# Altium project AMC_uBACKPLANE.PrjPcb (part 3 of 4)

## Sheet Supply.SchDoc: Supply
size 420 x 297 mm; DocumentNumber: 9; SheetNumber: 6; SheetTotal: 15
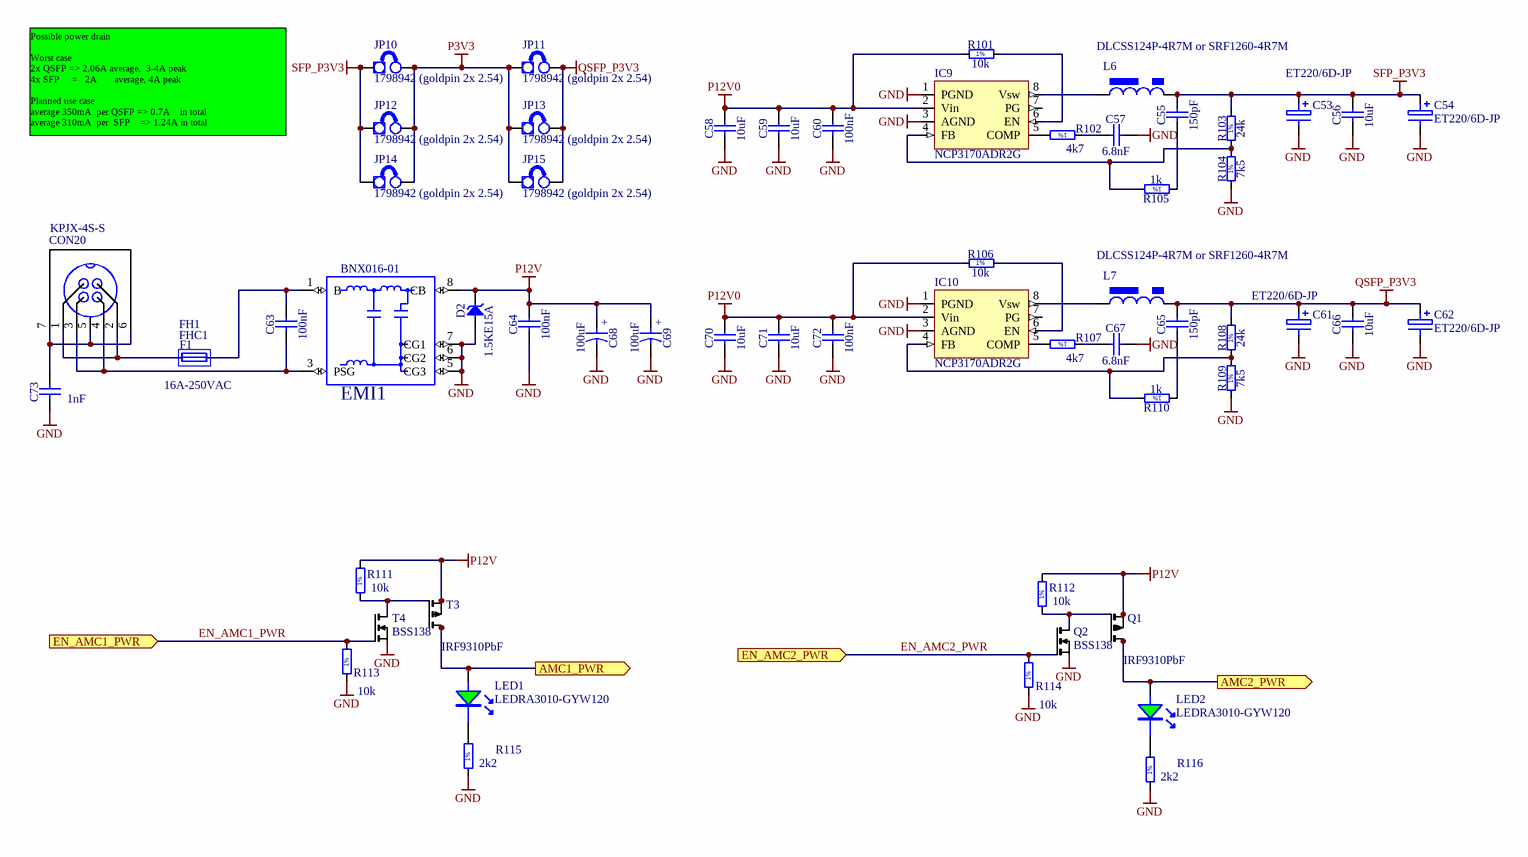
[diagram p9: Supply.SchDoc]

### Parts
C53  ET220/6D-JP  [2917_SMDD]
C54  ET220/6D-JP  [2917_SMDD]
C55  150pF  [CAPC1608X87N]
C56  10uF  [CAPC2012X135N]
C57  6.8nF  [CAPC1608X87N]
C58  10uF  [CAPC3216X140N]
C59  10uF  [CAPC3216X140N]
C60  100nF  [CAPC1005X55N]
C61  ET220/6D-JP  [2917_SMDD]
C62  ET220/6D-JP  [2917_SMDD]
C63  100nF  [CAPC1005X55N]
C64  100nF  [CAPC1005X55N]
C65  150pF  [CAPC1608X87N]
C66  10uF  [CAPC2012X135N]
C67  6.8nF  [CAPC1608X87N]
C68  100uF  [CAPMP7343X430N]
C69  100uF  [CAPMP7343X430N]
C70  10uF  [CAPC3216X140N]
C71  10uF  [CAPC3216X140N]
C72  100nF  [CAPC1005X55N]
C73  1nF  [CAPC3216X140N]
CON20  KPJX-4S-S  [CON_KPJX-4S-S]
D2  1.5KE15A  [VISHAY_1.5KE]
EMI1  BNX016-01  [BNX016-01]
F1  16A-250VAC  [FUSE_5X20_GLASS_h]
FH1  Fuse Holder  [FUSH_SCHURTER_OGN]  (value not drawn)
FHC1  Fuse Holder Cover No Pin  [FUSHC_SCHURTER_0853.0551]  (value not drawn)
IC9  NCP3170ADR2G  [so-8]
IC10  NCP3170ADR2G  [so-8]
JP10  1798942 (goldpin 2x 2.54)  [HEADER2x1 2.54mm]
JP11  1798942 (goldpin 2x 2.54)  [HEADER2x1 2.54mm]
JP12  1798942 (goldpin 2x 2.54)  [HEADER2x1 2.54mm]
JP13  1798942 (goldpin 2x 2.54)  [HEADER2x1 2.54mm]
JP14  1798942 (goldpin 2x 2.54)  [HEADER2x1 2.54mm]
JP15  1798942 (goldpin 2x 2.54)  [HEADER2x1 2.54mm]
L6  DLCSS124P-4R7M or SRF1260-4R7M  [choke_DLCSS124]
L7  DLCSS124P-4R7M or SRF1260-4R7M  [choke_DLCSS124]
LED1  LEDRA3010-GYW120  [LED_KPA3010_G]
LED2  LEDRA3010-GYW120  [LED_KPA3010_G]
Q1  IRF9310PbF  [so-8]
Q2  BSS138  [SOT95P251X112-3N]
R101  10k  [RESC1005X40N]
R102  4k7  [RESC1005X40N]
R103  24k  [RESC1608X55N]
R104  7k5  [RESC1608X55N]
R105  1k  [RESC1005X40N]
R106  10k  [RESC1005X40N]
R107  4k7  [RESC1005X40N]
R108  24k  [RESC1608X55N]
R109  7k5  [RESC1608X55N]
R110  1k  [RESC1005X40N]
R111  10k  [RESC1005X40N]
R112  10k  [RESC1005X40N]
R113  10k  [RESC1005X40N]
R114  10k  [RESC1005X40N]
R115  2k2  [RESC1005X40N]
R116  2k2  [RESC1005X40N]
T3  IRF9310PbF  [so-8]
T4  BSS138  [SOT95P251X112-3N]

### Ports
AMC1_PWR (out), AMC2_PWR (out), EN_AMC1_PWR (in), EN_AMC2_PWR (in)

### Nets
GND: C53.2 C54.2 C56.1 C57.2 C58.1 C59.1 C60.1 C61.2 C62.2 C64.1 C66.1 C67.2 C68.2 C69.2 C70.1 C71.1 C72.1 C73.1 D2.2(A) EMI1.5(CG3) EMI1.6(CG2) EMI1.7(CG1) IC9.1(PGND) IC9.3(AGND) IC10.1(PGND) IC10.3(AGND) Q2.2(S) R104.1 R109.1 R113.1 R114.1 R115.1 R116.1 T4.2(S)
P3V3: JP10.2(E2) JP11.1(E1) JP12.2(E2) JP13.1(E1) JP14.2(E2) JP15.1(E1)
P12V: C64.2 C68.1 C69.1 D2.1(C) EMI1.8(CB) Q1.1(S1) Q1.2(S1) Q1.3(S1) R111.2 R112.2 T3.1(S1) T3.2(S1) T3.3(S1)
P12V0: C58.2 C59.2 C60.2 C70.2 C71.2 C72.2 IC9.2(Vin) IC10.2(Vin) R101.1 R106.1
QSFP_P3V3: C61.1 C62.1 C65.2 C66.2 JP11.2(E2) JP13.2(E2) JP15.2(E2) L7.2 R108.2
SFP_P3V3: C53.1 C54.1 C55.2 C56.2 JP10.1(E1) JP12.1(E1) JP14.1(E1) L6.2 R103.2
AMC1_P12V: LED1.A T3.5(D1) T3.6(D1) T3.7(D1) T3.8(D1) ; port AMC1_PWR
AMC2_P12V: LED2.A Q1.5(D1) Q1.6(D1) Q1.7(D1) Q1.8(D1) ; port AMC2_PWR
EN_AMC1_PWR: R113.2 T4.1(G) ; port EN_AMC1_PWR  [project net AMC1_EN]
EN_AMC2_PWR: Q2.1(G) R114.2 ; port EN_AMC2_PWR  [project net AMC2_EN]
NetC55_1: C55.1 R105.1
NetC57_1: C57.1 R102.1
NetC63_1: C63.1 CON20.3 CON20.4 EMI1.3(PSG)
NetC63_2: C63.2 EMI1.1(B) FH1.2
NetC65_1: C65.1 R110.1
NetC67_1: C67.1 R107.1
NetC73_2: C73.2 CON20.5 CON20.6 CON20.7
NetCON20_1: CON20.1 CON20.2 FH1.1
NetIC9_4: IC9.4(FB) R103.1 R104.2 R105.2
NetIC9_5: IC9.5(COMP) R102.2
NetIC9_6: IC9.6(EN) R101.2
NetIC9_8: IC9.8(Vsw) L6.1
NetIC10_4: IC10.4(FB) R108.1 R109.2 R110.2
NetIC10_5: IC10.5(COMP) R107.2
NetIC10_6: IC10.6(EN) R106.2
NetIC10_8: IC10.8(Vsw) L7.1
NetLED1_K: LED1.K R115.2
NetLED2_K: LED2.K R116.2
NetQ1_4: Q1.4(G1) Q2.3(D) R112.1
NetR111_1: R111.1 T3.4(G1) T4.3(D)

Not connected (* = marked no-connect by the designer): IC9 7(PG); IC10 7(PG)

### Notes on the sheet
- Possible power drain
  Worst case
  2x QSFP => 2.06A average,  3-4A peak
  4x SFP     =   2A       average, 4A peak
  Planned use case
  average 350mA  per QSFP => 0.7A    in total
  average 310mA  per  SFP    => 1.24A in total
- Project/Equipment
- Document
- uTCA RTM 8 SFP+
- Designer
- Drawn by
- Check.by
- Copyright Creotech Instruments SA 2014.
  This documentation describes Open Hardware and is licensed under the CERN OHL v.1.1. You may redistribute and modify this documentation under the terms of the CERN OHL v.1.1. (http://ohwr.org/CERNOHL). This documentation is distributed WITHOUT ANY EXPRESS OR IMPLIED WARRANTY, INCLUDING OF MERCHANTABILITY, SATISFACTORY QUALITY AND FITNESS FOR A PARTICULAR PURPOSE. Please see the CERN OHL v.1.1 for applicable conditions.
- Creotech Instruments S.A.
- File
- Last Mod.
- Print Date
- Sheet
- Size
- A3
- of
- Rev
- (in symbol CTE7343-43_100UF_20V_10%_LESR0150) +
- (in symbol R0402_1K_1%_0.0625W_100PPM) 1%
- (in symbol R0402_2K2_1%_0.0625W_100PPM) 1%
- (in symbol R0402_4K7_1%_0.0625W_100PPM) 1%
- (in symbol R0402_10K_1%_0.0625W_100PPM) 1%
- (in symbol R0603_7K5_1%_0.1W_100PPM) 1%
- (in symbol R0603_24K_1%_0.1W_100PPM) 1%

### Library data of the parts
C53 C54 C61 C62 = CAP_TANTALIUM: Tantalium Capacitor
C55 C65 = CC0603_150PF_50V_5%_NP0: Non-polarised capacitor; Part Description: SMD Multilayer Chip Ceramic Capacitor; Manufacturer: GENERIC; Manufacturer1 Part Number: 223886715151; Voltage: 50V; TC: NP0; Tolerance: ±5%; Table: Capacitors SMD; Part Number: CC0603_150PF_50V_5%_NP0; Component Kind: Standard; Component Type: Standard; Pin Count: 2; Value: 150pF; Status: Preferred; Manufacturer Part Number: CC0603_150PF_50V_5%_NP0; Case: 0603; Mounted: Yes; Socket: No; SMD: Yes; Manufacturer1 Example: PHYCOMP; Manufacturer1 ComponentHeight: 0.87mm; HelpURL: \\cern.ch\dfs\Applications\Altium\Datasheets\CC0603_NP0_PHYCOMP.pdf; Author: CERN DEM JLC; CreateDate: 2007-12-03; LatestRevisionDate: 2007-12-03
C56 C66 = CC0805_10UF_10V_10%_X7R: Non-polarised capacitor; Part Description: SMD Multilayer Chip Ceramic Capacitor; Manufacturer: GENERIC; Manufacturer1 Part Number: GRM21BR71A106KE51L; Voltage: 10V; TC: X7R; Tolerance: ±10%; Table: Capacitors SMD; Part Number: CC0805_10UF_10V_10%_X7R; Component Kind: Standard; Component Type: Standard; Pin Count: 2; Value: 10uF; Status: Preferred; Manufacturer Part Number: CC0805_10UF_10V_10%_X7R; Case: 0805; Mounted: Yes; Socket: No; SMD: Yes; Manufacturer1 Example: MURATA; Manufacturer1 ComponentHeight: 1.35mm; HelpURL: \\cern.ch\dfs\Applications\Altium\Datasheets\CC0805_X7R_MURATA.pdf; Author: CERN DEM JLC; CreateDate: 2012-04-30; LatestRevisionDate: 2012-04-30
C57 C67 = CC0603_6.8NF_50V_5%_C0G: Non-polarised capacitor; Part Description: SMD Multilayer Chip Ceramic Capacitor; Manufacturer: GENERIC; Manufacturer1 Part Number: C0603C682J5GACTU; Voltage: 50V; TC: C0G; Tolerance: ±5%; Table: Capacitors SMD; Part Number: CC0603_6.8NF_50V_5%_C0G; Component Kind: Standard; Component Type: Standard; Pin Count: 2; Value: 6.8nF; Status: Preferred; Manufacturer Part Number: CC0603_6.8NF_50V_5%_C0G; Case: 0603; Mounted: Yes; Socket: No; SMD: Yes; Manufacturer1 Example: KEMET; Manufacturer1 ComponentHeight: 0.87mm; HelpURL: \\cern.ch\dfs\Applications\Altium\Datasheets\CC0603_C0G_KEMET.pdf; Author: CERN DEM JLC; CreateDate: 2013-10-01; LatestRevisionDate: 2013-10-01
C58 C59 C70 C71 = CC1206_10UF_16V_10%_X7R: Non-polarised capacitor; Part Description: SMD Multilayer Chip Ceramic Capacitor; Manufacturer: GENERIC; Manufacturer1 Part Number: C1206C106K4RAC; Voltage: 16V; TC: X7R; Tolerance: ±10%; Table: Capacitors SMD; Part Number: CC1206_10UF_16V_10%_X7R; Component Kind: Standard; Component Type: Standard; Pin Count: 2; Value: 10uF; Status: Preferred; Manufacturer Part Number: CC1206_10uF_16V_10%_X7R; Case: 1206; Mounted: Yes; Socket: No; SMD: Yes; Manufacturer1 Example: KEMET; Manufacturer1 ComponentHeight: 1.8mm; HelpURL: \\cern.ch\dfs\Applications\Altium\Datasheets\CC1206_X7R_KEMET.pdf; Author: CERN DEM JLC; CreateDate: 2009-04-28; LatestRevisionDate: 2009-04-28
C60 C63 C64 C72 = CC0402_100NF_16V_10%_X5R: Non-polarised capacitor; Part Description: SMD Multilayer Chip Ceramic Capacitor; Manufacturer: GENERIC; Manufacturer1 Part Number: GRM155R61C104KA88D; Voltage: 16V; TC: X5R; Tolerance: ±10%; Table: Capacitors SMD; Part Number: CC0402_100NF_16V_10%_X5R; Component Kind: Standard; Component Type: Standard; Pin Count: 2; Value: 100nF; Status: None; Manufacturer Part Number: CC0402_100NF_16V_10%_X5R; Case: 0402; Mounted: Yes; Socket: No; SMD: Yes; Manufacturer1 Example: MURATA; Manufacturer1 ComponentHeight: 0.55mm; HelpURL: \\cern.ch\dfs\Applications\Altium\Datasheets\CC0402_X5R_MURATA_GRM.pdf; Author: CERN DEM JLC; CreateDate: 2013-12-10; LatestRevisionDate: 2013-12-10
C68 C69 = CTE7343-43_100UF_20V_10%_LESR0150: Polarised capacitor; Part Description: Low ESR 0R15 Solid Tantalum Chip Capacitor; Manufacturer: GENERIC; Manufacturer1 Part Number: TPSE107K020R0150; Voltage: 20V; Tolerance: ±10%; Table: Capacitors SMD; Part Number: CTE7343-43_100UF_20V_10%_LESR0150; Component Kind: Standard; Component Type: Standard; Pin Count: 2; Value: 100uF; Status: Preferred; Manufacturer Part Number: CTE7343-43_100UF_20V_10%_LESR0150; Case: E; Mounted: Yes; Socket: No; SMD: Yes; Manufacturer1 Example: AVX; Manufacturer1 ComponentHeight: 4.3mm; HelpURL: \\cern.ch\dfs\Applications\Altium\Datasheets\CTE-LESR_AVX_TPS.pdf; Author: CERN DEM JLC; CreateDate: 2008-05-05; LatestRevisionDate: 2009-01-20
C73 = CC1206_1NF_100V_5%_NP0: Non-polarised capacitor; Part Description: SMD Multilayer Chip Ceramic Capacitor; Manufacturer: GENERIC; Manufacturer1 Part Number: 12061A102JAT2A; Voltage: 100V; TC: NP0; Tolerance: ±5%; Table: Capacitors SMD; Part Number: CC1206_1NF_100V_5%_NP0; Component Kind: Standard; Component Type: Standard; Pin Count: 2; Value: 1nF; Status: Preferred; Manufacturer Part Number: CC1206_1NF_100V_5%_NP0; Case: 1206; Mounted: Yes; Socket: No; SMD: Yes; Manufacturer1 Example: AVX; Manufacturer1 ComponentHeight: 0.94mm; HelpURL: \\cern.ch\dfs\Applications\Altium\Datasheets\CC1206_NP0_AVX.pdf; Author: CERN DEM JLC; CreateDate: 2011-04-06; LatestRevisionDate: 2011-04-06
CON20 = CON_DC_7.5A_4pin: 7.5A DC connector
D2 = 1.5KE15A: Transient Voltage Suppressor Diode (Uni-Directional); Part Description: Uni-directional  Transient Voltage Suppressor Diode - TRANSZORB®; Manufacturer: VISHAY GENERAL SEMICONDUCTOR; Voltage: 15V; Power: 1500W; Table: Diodes; Part Number: 1.5KE15A; Component Kind: Standard; Component Type: Standard; Device: 1.5KE15A; PackageDescription: VISHAY 1.5KE Case Style, Diode, Axial; Lead Spacing 20.32mm, Lead Dia. 1.07mm, Body Length 9.5mm, Body Dia. 5.3mm; Manufacturer Part Number: 1.5KE15A; Pin Count: 2; Mounted: Yes; Socket: No; SMD: No; ComponentHeight: 5.3mm; HelpURL: \\cern.ch\dfs\Applications\Altium\Datasheets\1.5KE.pdf; Author: CERN DEM JLC; CreateDate: 2012-12-11; LatestRevisionDate: 2012-12-11
EMI1 = L_CMC_BNX016-01.1: FILTER EMI 50MOHM 15A .1M-1GHZ; PART_TYPE: COMBINED; DXDB_LIBNAME: FILTERS; OWNER: 3709; DIST_P/N: 490-5055-ND; DIST: DIGIKEY; MANF: MURATA; DEVICE: BNX016-01; PKG_TYPE: BNX016-01; MANF_P/N: BNX016-01; DATASHEET: \\XSJ-SMB\AFX\AFX\BOARD_PROJECTS\LIBRARY\\DATASHEETS\FILTER\L0117BNX01.PDF; ROHS: YES; CURRENT: 15A; VALUE: 50MOHM
F1 = FUSE_SCHURTER_0034.3129_h: Fuse; Part Description: Cylindrical 5x20 mm, Time-Lag T Miniature Fuse, FST Serie; Table: Fuses; Part Number: FUSE_SCHURTER_0034.3129_h; Component Kind: Standard; Component Type: Standard; Pin Count: 0; PackageDescription: 5x20mm Cylindrical Fuse, SCHURTER FST5X20 Serie; Family: Fuse; Mounted: Yes; Socket: Yes; SMD: No; Value: 16A-250VAC; Manufacturer: SCHURTER; Manufacturer Part Number: 0034.3129; ComponentHeight: 5.2mm; HelpURL: \\cern.ch\dfs\Applications\Altium\Datasheets\FUSE_SCHURTER_FST5X20.pdf; Author: CERN DEM JLC; CreateDate: 2013-01-28; LatestRevisionDate: 2013-01-28
FH1 = FUSH_SCHURTER-OGN_0031.8211: Part Description: Fuse holder for 5x20mm Fuses; Table: Fuses; Part Number: FUSH_SCHURTER-OGN_0031.8211; Component Kind: Standard; Component Type: Standard; Pin Count: 2; PackageDescription: SCHURTER OGN Series, Fuse holder for 5x20mm Fuses; Family: Fuse Holder; Mounted: Yes; Socket: No; SMD: No; Manufacturer: SCHURTER; Manufacturer Part Number: 0031.8211; ComponentHeight: 11.5mm; HelpURL: \\cern.ch\dfs\Applications\Altium\Datasheets\FUSH_SCHURTER_OGN.pdf; Author: CERN DEM JLC; CreateDate: 2008-06-03; LatestRevisionDate: 2008-07-02
FHC1 = FUSHC_SCHURTER_0853.0551: Part Description: Cover for Fuse Holder OGN, OGN-SMD; Table: Fuses; Part Number: FUSHC_SCHURTER_0853.0551; Component Kind: Standard; Component Type: Standard; Pin Count: 0; PackageDescription: Cover for Fuse Holder OGN, OGN-SMD; Family: Fuse Holder Cover; Mounted: Yes; Socket: No; SMD: No; Manufacturer: SCHURTER; Manufacturer Part Number: 0853.0551; ComponentHeight: 12.5mm; HelpURL: \\cern.ch\dfs\Applications\Altium\Datasheets\FUSHC_SCHURTER_0853.0551.pdf; Author: CERN DEM JLC; CreateDate: 2013-03-06; LatestRevisionDate: 2013-03-06
IC9 IC10 = PWM_NCP3170: 4.5V to 18V, 3A synch buck
JP10-JP15 = JUMPER: Supplier 1: Farnell; Supplier Part Number 1: 1798942
L6 L7 = L_POWER_CSS124_6.8uH: Shielded Ferrite base SMD Power Choke DLCSS124P Series 4.7uH, 20%, 5.7A, 0.018R, 750pcs/reel
LED1 LED2 = LED_SMD_90deg_G: LED (Maritex); Supplier 1: Farnell; Supplier Part Number 1: 8530335RL
Q1 T3 = Q_IRF9310: PMOS 30V, 4.6mR, 20A, 2.5W
Q2 T4 = Q_BSS138
R101 R106 R111-R114 = R0402_10K_1%_0.0625W_100PPM: Resistor - 1%; Part Description: General Purpose Thick Film Chip Resistor; Manufacturer: GENERIC; Manufacturer1 Part Number: 232270671003L; TC: ±100ppm/°C; Table: Resistors SMD; Part Number: R0402_10K_1%_0.0625W_100PPM; Component Kind: Standard; Component Type: Standard; Pin Count: 2; Value: 10k; Status: Not recommended; Power: 0.0625W; Tolerance: ±1%; Manufacturer Part Number: R0402_10K_1%_0.0625W_100PPM; Case: 0402; Mounted: Yes; Socket: No; SMD: Yes; Manufacturer1 Example: YAGEO PHYCOMP; Manufacturer1 ComponentHeight: 0.4mm; HelpURL: \\cern.ch\dfs\Applications\Altium\Datasheets\R0402_Phycomp_RC0402.pdf; Author: CERN DEM JLC; CreateDate: 2007-12-03; LatestRevisionDate: 2012-10-17
R102 R107 = R0402_4K7_1%_0.0625W_100PPM: Resistor - 1%; Part Description: General Purpose Thick Film Chip Resistor; Manufacturer: GENERIC; Manufacturer1 Part Number: 232270674702L; TC: ±100ppm/°C; Table: Resistors SMD; Part Number: R0402_4K7_1%_0.0625W_100PPM; Component Kind: Standard; Component Type: Standard; Pin Count: 2; Value: 4k7; Status: Not recommended; Power: 0.0625W; Tolerance: ±1%; Manufacturer Part Number: R0402_4K7_1%_0.0625W_100PPM; Case: 0402; Mounted: Yes; Socket: No; SMD: Yes; Manufacturer1 Example: YAGEO PHYCOMP; Manufacturer1 ComponentHeight: 0.4mm; HelpURL: \\cern.ch\dfs\Applications\Altium\Datasheets\R0402_Phycomp_RC0402.pdf; Author: CERN DEM JLC; CreateDate: 2007-12-03; LatestRevisionDate: 2012-10-17
R103 R108 = R0603_24K_1%_0.1W_100PPM: Resistor - 1%; Part Description: General Purpose Thick Film Chip Resistor; Manufacturer: GENERIC; Manufacturer1 Part Number: NRC06F2402TRF; Power: 0.1W; TC: ±100ppm/°C; Table: Resistors SMD; Part Number: R0603_24K_1%_0.1W_100PPM; Component Kind: Standard; Component Type: Standard; Pin Count: 2; Value: 24k; Status: Preferred; Tolerance: ±1%; Manufacturer Part Number: R0603_24K_1%_0.1W_100PPM; Case: 0603; Mounted: Yes; Socket: No; SMD: Yes; Manufacturer1 Example: NIC COMPONENT; Manufacturer1 ComponentHeight: 0.55mm; HelpURL: \\cern.ch\dfs\Applications\Altium\Datasheets\R0603_NIC_NRC.pdf; Author: CERN DEM JLC; CreateDate: 2007-12-03; LatestRevisionDate: 2008-03-13
R104 R109 = R0603_7K5_1%_0.1W_100PPM: Resistor - 1%; Part Description: General Purpose Thick Film Chip Resistor; Manufacturer: GENERIC; Manufacturer1 Part Number: NRC06F7501TRF; Power: 0.1W; TC: ±100ppm/°C; Table: Resistors SMD; Part Number: R0603_7K5_1%_0.1W_100PPM; Component Kind: Standard; Component Type: Standard; Pin Count: 2; Value: 7k5; Status: Preferred; Tolerance: ±1%; Manufacturer Part Number: R0603_7K5_1%_0.1W_100PPM; Case: 0603; Mounted: Yes; Socket: No; SMD: Yes; Manufacturer1 Example: NIC COMPONENT; Manufacturer1 ComponentHeight: 0.55mm; HelpURL: \\cern.ch\dfs\Applications\Altium\Datasheets\R0603_NIC_NRC.pdf; Author: CERN DEM JLC; CreateDate: 2007-12-03; LatestRevisionDate: 2008-03-13
R105 R110 = R0402_1K_1%_0.0625W_100PPM: Resistor - 1%; Part Description: General Purpose Thick Film Chip Resistor; Manufacturer: GENERIC; Manufacturer1 Part Number: 232270671002L; TC: ±100ppm/°C; Table: Resistors SMD; Part Number: R0402_1K_1%_0.0625W_100PPM; Component Kind: Standard; Component Type: Standard; Pin Count: 2; Value: 1k; Status: Not recommended; Power: 0.0625W; Tolerance: ±1%; Manufacturer Part Number: R0402_1K_1%_0.0625W_100PPM; Case: 0402; Mounted: Yes; Socket: No; SMD: Yes; Manufacturer1 Example: YAGEO PHYCOMP; Manufacturer1 ComponentHeight: 0.4mm; HelpURL: \\cern.ch\dfs\Applications\Altium\Datasheets\R0402_Phycomp_RC0402.pdf; Author: CERN DEM JLC; CreateDate: 2007-12-03; LatestRevisionDate: 2012-10-17
R115 R116 = R0402_2K2_1%_0.0625W_100PPM: Resistor - 1%; Part Description: General Purpose Thick Film Chip Resistor; Manufacturer: GENERIC; Manufacturer1 Part Number: 232270672202L; TC: ±100ppm/°C; Table: Resistors SMD; Part Number: R0402_2K2_1%_0.0625W_100PPM; Component Kind: Standard; Component Type: Standard; Pin Count: 2; Value: 2k2; Status: Not recommended; Power: 0.0625W; Tolerance: ±1%; Manufacturer Part Number: R0402_2K2_1%_0.0625W_100PPM; Case: 0402; Mounted: Yes; Socket: No; SMD: Yes; Manufacturer1 Example: YAGEO PHYCOMP; Manufacturer1 ComponentHeight: 0.4mm; HelpURL: \\cern.ch\dfs\Applications\Altium\Datasheets\R0402_Phycomp_RC0402.pdf; Author: CERN DEM JLC; CreateDate: 2007-12-03; LatestRevisionDate: 2012-10-17

## Sheet USB_UART.SchDoc: USB UART
size 420 x 297 mm; DocumentNumber: 11; SheetNumber: 12; SheetTotal: 15
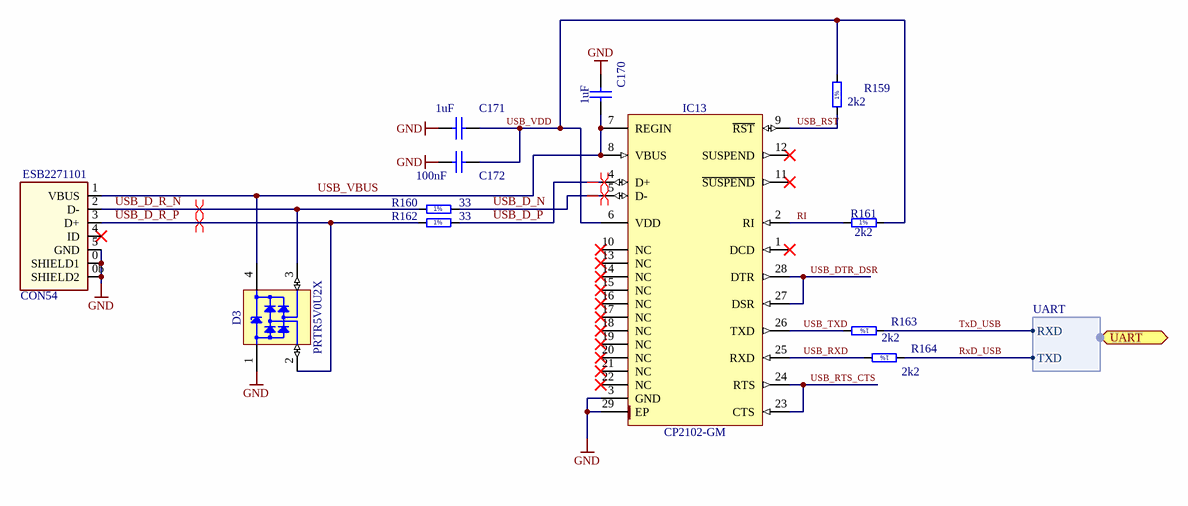
[diagram p10: USB_UART.SchDoc]

### Parts
C170  1uF  [CAPC1608X87N]
C171  1uF  [CAPC1608X87N]
C172  100nF  [CAPC0603X33N]
CON54  ESB2271101  [USB_MICRO_ESB2271101]
D3  PRTR5V0U2X  [SOT190P230X110-4N]
IC13  CP2102-GM  [QFN50P500X500X100-29N-S335]
R159  2k2  [RESC1005X40N]
R160  33  [RESC1005X40N]
R161  2k2  [RESC1005X40N]
R162  33  [RESC1005X40N]
R163  2k2  [RESC1005X40N]
R164  2k2  [RESC1005X40N]

### Ports
UART (harness UART)

### Harnesses
UART: RXD, TXD

### Nets
GND: C170.1 C171.1 C172.1 CON54.0(SHIELD1) CON54.0a(SHIELD1) CON54.0b(SHIELD2) CON54.0c(SHIELD2) CON54.5(GND) D3.1(GND) IC13.3(GND) IC13.29(EP)
RI: IC13.2(RI) R161.1
RxD_USB: R164.1 ; port UART.TXD  [project net UART.TXD]
TxD_USB: R163.1 ; port UART.RXD  [project net UART.RXD]
USB_D_N: IC13.5(D-) R160.2
USB_D_P: IC13.4(D+) R162.2
USB_D_R_N: CON54.2(D-) D3.3(I/O2) R160.1
USB_D_R_P: CON54.3(D+) D3.2(I/O1) R162.1
USB_DTR_DSR: IC13.27(DSR) IC13.28(DTR)
USB_RST: IC13.9(~{RST}) R159.1
USB_RTS_CTS: IC13.23(CTS) IC13.24(RTS)
USB_RXD: IC13.25(RXD) R164.2
USB_TXD: IC13.26(TXD) R163.2
USB_VBUS: C170.2 CON54.1(VBUS) D3.4(VCC) IC13.7(REGIN) IC13.8(VBUS)
USB_VDD: C171.2 C172.2 IC13.6(VDD) R159.2 R161.2

Not connected (* = marked no-connect by the designer): CON54 4(ID)*; IC13 1(DCD)* 10(NC)* 11(~{SUSPEND})* 12(SUSPEND)* 13(NC)* 14(NC)* 15(NC)* 16(NC)* 17(NC)* 18(NC)* 19(NC)* 20(NC)* 21(NC)* 22(NC)*

### Layout directives
differential pair: USB_D_N, USB_D_P, USB_D_R_N, USB_D_R_P

### Notes on the sheet
- Project/Equipment
- Document
- uTCA RTM 8 SFP+
- Designer
- Drawn by
- Check.by
- Copyright Creotech Instruments SA 2014.
  This documentation describes Open Hardware and is licensed under the CERN OHL v.1.1. You may redistribute and modify this documentation under the terms of the CERN OHL v.1.1. (http://ohwr.org/CERNOHL). This documentation is distributed WITHOUT ANY EXPRESS OR IMPLIED WARRANTY, INCLUDING OF MERCHANTABILITY, SATISFACTORY QUALITY AND FITNESS FOR A PARTICULAR PURPOSE. Please see the CERN OHL v.1.1 for applicable conditions.
- Creotech Instruments S.A.
- File
- Last Mod.
- Print Date
- Sheet
- Size
- A3
- of
- Rev
- (in symbol R0402_2K2_1%_0.0625W_100PPM) 1%
- (in symbol R0402_33R_1%_0.0625W_100PPM) 1%

### Library data of the parts
C170 C171 = CC0603_1UF_16V_10%_X7R: Non-polarised capacitor; Part Description: SMD Multilayer Chip Ceramic Capacitor; Manufacturer: GENERIC; Manufacturer1 Part Number: 223824613663; Voltage: 16V; TC: X7R; Tolerance: ±10%; Table: Capacitors SMD; Part Number: CC0603_1UF_16V_10%_X7R; Component Kind: Standard; Component Type: Standard; Pin Count: 2; Value: 1uF; Status: Preferred; Manufacturer Part Number: CC0603_1uF_16V_10%_X7R; Case: 0603; Mounted: Yes; Socket: No; SMD: Yes; Manufacturer1 Example: PHYCOMP; Manufacturer1 ComponentHeight: 0.87mm; HelpURL: \\cern.ch\dfs\Applications\Altium\Datasheets\CC0805_X5R_PHYCOMP_HC.pdf; Author: CERN DEM JLC; CreateDate: 2007-12-03; LatestRevisionDate: 2007-12-03
C172 = CC0201_100NF_6.3V_10%_X5R: as C74-C78 on sheet AMC; Part Number: CC0201_100NF_6.3V_10%_X5R; Component Kind: Standard; Component Type: Standard; Pin Count: 2; Value: 100nF; Status: Not Recommended; Manufacturer Part Number: CC0201_100NF_6.3V_10%_X5R; Case: 0201; Mounted: Yes; Socket: No; SMD: Yes; Manufacturer1 Example: AVX; Manufacturer1 ComponentHeight: 0.33mm; HelpURL: \\cern.ch\dfs\Applications\Altium\Datasheets\CC0201_X5R_AVX.pdf; Author: CERN DEM JLC; CreateDate: 2007-12-03; LatestRevisionDate: 2007-12-03
CON54 = CON_USB_AB_MICRO: USB micro AB connector; Part Number: 10133; Device: USB_Mini_AB
D3 = PRTR5V0U2X: Ultra Low Capacitance Double Rail-to-Rail ESD Protection Diode; Part Description: Ultra Low Capacitance (1pF) Double Rail-to-Rail ESD Protection Diode (8kV); Manufacturer: NXP SEMICONDUCTORS; Voltage: 5.5V; Table: Diodes; Part Number: PRTR5V0U2X; Component Kind: Standard; Component Type: Standard; Device: PRTR5V0U2X; PackageDescription: SOT143B, SOT, 1.90mm Pitch; 4 Pin, 1.30mm W X 2.90mm L X 1.10mm H body, IPC Medium Density; Manufacturer Part Number: PRTR5V0U2X; Pin Count: 4; Case: SOT143B; Mounted: Yes; Socket: No; SMD: Yes; ComponentHeight: 1.1mm; HelpURL: \\cern.ch\dfs\Applications\Altium\Datasheets\PRTR5V0U2X.pdf; Author: CERN DEM JLC; CreateDate: 2011-03-22; LatestRevisionDate: 2011-03-22
IC13 = CP2102-GM: Single-Chip USB to UART Bridge; Manufacturer: SILICON LABS; Table: Analog & Interface; Part Number: CP2102-GM; Component Kind: Standard; Component Type: Standard; Device: CP2102-GM; PackageDescription: QFN, 0.50mm Pitch, Square; 28 pin, 5.00mm L X 5.00mm W X 1.00mm H body (w/thermal tab 3.35 X 3.35mm),  IPC Medium Density; Part Description: Single-Chip USB to UART Bridge; Manufacturer Part Number: CP2102-GM; Pin Count: 29; Case: QFN28; Mounted: Yes; Socket: No; SMD: Yes; ComponentHeight: 1.0mm; Author: CERN DEM JLC; HelpURL: \\cern.ch\dfs\Applications\Altium\Datasheets\CP2102-GM.pdf; CreateDate: 3/3/2011; LatestRevisionDate: 3/3/2011
R159 R161 R163 R164 = R0402_2K2_1%_0.0625W_100PPM: as R115 on sheet Supply; Part Number: R0402_2K2_1%_0.0625W_100PPM; Component Kind: Standard; Component Type: Standard; Pin Count: 2; Value: 2k2; Status: Not recommended; Power: 0.0625W; Tolerance: ±1%; Manufacturer Part Number: R0402_2K2_1%_0.0625W_100PPM; Case: 0402; Mounted: Yes; Socket: No; SMD: Yes; Manufacturer1 Example: YAGEO PHYCOMP; Manufacturer1 ComponentHeight: 0.4mm; HelpURL: \\cern.ch\dfs\Applications\Altium\Datasheets\R0402_Phycomp_RC0402.pdf; Author: CERN DEM JLC; CreateDate: 2007-12-03; LatestRevisionDate: 2012-10-17
R160 R162 = R0402_33R_1%_0.0625W_100PPM: Resistor - 1%; Part Description: General Purpose Thick Film Chip Resistor; Manufacturer: GENERIC; Manufacturer1 Part Number: 232270673309L; TC: ±100ppm/°C; Table: Resistors SMD; Part Number: R0402_33R_1%_0.0625W_100PPM; Component Kind: Standard; Component Type: Standard; Pin Count: 2; Value: 33; Status: Not recommended; Power: 0.0625W; Tolerance: ±1%; Manufacturer Part Number: R0402_33R_1%_0.0625W_100PPM; Case: 0402; Mounted: Yes; Socket: No; SMD: Yes; Manufacturer1 Example: YAGEO PHYCOMP; Manufacturer1 ComponentHeight: 0.4mm; HelpURL: \\cern.ch\dfs\Applications\Altium\Datasheets\R0402_Phycomp_RC0402.pdf; Author: CERN DEM JLC; CreateDate: 2007-12-03; LatestRevisionDate: 2012-10-17

## Sheet ETH_PHY.SchDoc: ETH PHY
size 420 x 297 mm; DocumentNumber: 5; SheetNumber: 14; SheetTotal: 15
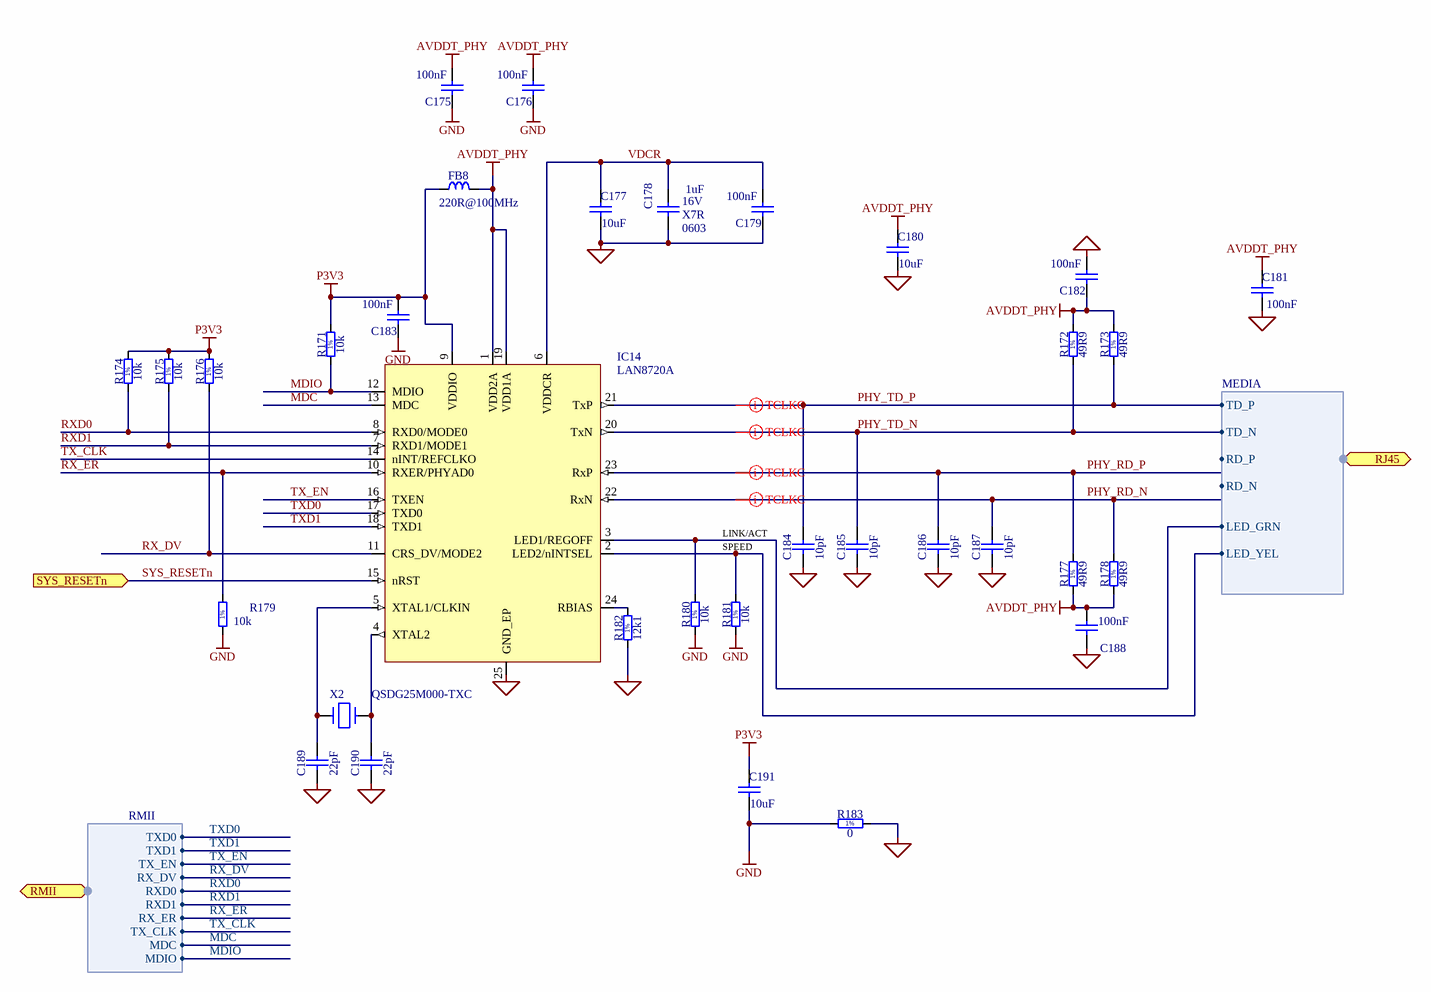
[diagram p11: ETH_PHY.SchDoc]

### Parts
C175  100nF  [CAPC1005X55N]
C176  100nF  [CAPC1005X55N]
C177  10uF  [CAPC2012X135N]
C178  1uF  Voltage: 16V  TC: X7R  Case: 0603  [CAPC1608X87N]
C179  100nF  [CAPC1005X55N]
C180  10uF  [CAPC2012X135N]
C181  100nF  [CAPC1005X55N]
C182  100nF  [CAPC1005X55N]
C183  100nF  [CAPC1005X55N]
C184  10pF  [CAPC1005X55N]
C185  10pF  [CAPC1005X55N]
C186  10pF  [CAPC1005X55N]
C187  10pF  [CAPC1005X55N]
C188  100nF  [CAPC1005X55N]
C189  22pF  [CAPC1005X55N]
C190  22pF  [CAPC1005X55N]
C191  10uF  [CAPC2012X135N]
FB8  220R@100MHz  [INDC2012X105N]
IC14  LAN8720A  [QFN24-TP]
R171  10k  [RESC1005X40N]
R172  49R9  [RESC1005X40N]
R173  49R9  [RESC1005X40N]
R174  10k  [RESC1005X40N]
R175  10k  [RESC1005X40N]
R176  10k  [RESC1005X40N]
R177  49R9  [RESC1005X40N]
R178  49R9  [RESC1005X40N]
R179  10k  [RESC1005X40N]
R180  10k  [RESC1005X40N]
R181  10k  [RESC1005X40N]
R182  12k1  [RESC1005X40N]
R183  0  [RESC1608X55N]
X2  QSDG25M000-TXC  [XTAL_5.0*3.2]

### Ports
RJ45 (harness MEDIA), RMII (harness RMII), SYS_RESETn (in)

### Harnesses
RMII: TXD0, TXD1, TX_EN, RX_DV, RXD0, RXD1, RX_ER, TX_CLK, MDC, MDIO
MEDIA: TD_P, TD_N, RD_P, RD_N, LED_GRN, LED_YEL

### Nets
AVDDT_PHY: C175.1 C176.1 C180.1 C181.2 C182.2 C188.1 FB8.2 IC14.1(VDD2A) IC14.19(VDD1A) R172.2 R173.2 R177.1 R178.1
GND: C175.2 C176.2 C183.2 C191.2 R179.1 R180.1 R181.1 R183.1
GND_ETH: C177.2 C178.1 C179.2 C180.2 C181.1 C182.1 C184.1 C185.1 C186.1 C187.1 C188.2 C189.1 C190.1 IC14.25(GND_EP) R182.1 R183.2
P3V3: C183.1 C191.1 FB8.1 IC14.9(VDDIO) R171.2 R174.2 R175.2 R176.2
MDC: IC14.13(MDC) ; port RMII.MDC  [project net RMII.MDC]
MDIO: IC14.12(MDIO) R171.1 ; port RMII.MDIO  [project net RMII.MDIO]
PHY_RD_N: C187.2 IC14.22(RxN) R178.2
PHY_RD_P: C186.2 IC14.23(RxP) R177.2
PHY_TD_N: C185.2 IC14.20(TxN) R172.1 ; port RJ45.TD_N  [project net RJ45.TD_N]
PHY_TD_P: C184.2 IC14.21(TxP) R173.1 ; port RJ45.TD_P  [project net RJ45.TD_P]
RJ45.LED_GRN: IC14.3(LED1/REGOFF) R180.2 ; port RJ45.LED_GRN
RJ45.LED_YEL: IC14.2(LED2/nINTSEL) R181.2 ; port RJ45.LED_YEL
RX_DV: IC14.11(CRS_DV/MODE2) R176.1 ; port RMII.RX_DV  [project net RMII.RX_DV]
RX_ER: IC14.10(RXER/PHYAD0) R179.2 ; port RMII.RX_ER  [project net RMII.RX_ER]
RXD0: IC14.8(RXD0/MODE0) R174.1 ; port RMII.RXD0  [project net RMII.RXD0]
RXD1: IC14.7(RXD1/MODE1) R175.1 ; port RMII.RXD1  [project net RMII.RXD1]
SYS_RESETn: IC14.15(nRST) ; port SYS_RESETn  [project net RSTO]
TX_CLK: IC14.14(nINT/REFCLKO) ; port RMII.TX_CLK  [project net RMII.TX_CLK]
TX_EN: IC14.16(TXEN) ; port RMII.TX_EN  [project net RMII.TX_EN]
TXD0: IC14.17(TXD0) ; port RMII.TXD0  [project net RMII.TXD0]
TXD1: IC14.18(TXD1) ; port RMII.TXD1  [project net RMII.TXD1]
VDCR: C177.1 C178.2 C179.1 IC14.6(VDDCR)
NetC189_2: C189.2 IC14.5(XTAL1/CLKIN) X2.1
NetC190_2: C190.2 IC14.4(XTAL2) X2.2
NetIC14_24: IC14.24(RBIAS) R182.2

### Layout directives
differential pair: PHY_RD_N, PHY_RD_P, RJ45.TD_N, RJ45.TD_P

### Notes on the sheet
- SPEED
- LINK/ACT
- Project/Equipment
- Document
- uTCA RTM 8 SFP+
- Designer
- Drawn by
- Check.by
- Copyright Creotech Instruments SA 2014.
  This documentation describes Open Hardware and is licensed under the CERN OHL v.1.1. You may redistribute and modify this documentation under the terms of the CERN OHL v.1.1. (http://ohwr.org/CERNOHL). This documentation is distributed WITHOUT ANY EXPRESS OR IMPLIED WARRANTY, INCLUDING OF MERCHANTABILITY, SATISFACTORY QUALITY AND FITNESS FOR A PARTICULAR PURPOSE. Please see the CERN OHL v.1.1 for applicable conditions.
- Creotech Instruments S.A.
- File
- Last Mod.
- Print Date
- Sheet
- Size
- A3
- of
- Rev
- (in symbol R0402_10K_1%_0.0625W_100PPM) 1%
- (in symbol R0402_12K1_1%_0.0625W_100PPM) 1%
- (in symbol R0402_49R9_1%_0.0625W_100PPM) 1%
- (in symbol R0603_0R_JUMPER) 1%

### Library data of the parts
C175 C176 C179 C181-C183 C188 = CC0402_100NF_16V_10%_X7R: Non-polarised capacitor; Part Description: SMD Multilayer Chip Ceramic Capacitor; Manufacturer: GENERIC; Manufacturer1 Part Number: 223878715649; Voltage: 16V; TC: X7R; Tolerance: ±10%; Table: Capacitors SMD; Part Number: CC0402_100NF_16V_10%_X7R; Component Kind: Standard; Component Type: Standard; Pin Count: 2; Value: 100nF; Status: Not Recommended; Manufacturer Part Number: CC0402_100NF_16V_10%_X7R; Case: 0402; Mounted: Yes; Socket: No; SMD: Yes; Manufacturer1 Example: PHYCOMP; Manufacturer1 ComponentHeight: 0.55mm; HelpURL: \\cern.ch\dfs\Applications\Altium\Datasheets\CC0402_X7R_PHYCOMP.pdf; Author: CERN DEM JLC; CreateDate: 2007-12-03; LatestRevisionDate: 2007-12-03
C177 C180 C191 = CC0805_10UF_10V_10%_X7R: as C56 on sheet Supply; Part Number: CC0805_10UF_10V_10%_X7R; Component Kind: Standard; Component Type: Standard; Pin Count: 2; Value: 10uF; Status: Preferred; Manufacturer Part Number: CC0805_10UF_10V_10%_X7R; Case: 0805; Mounted: Yes; Socket: No; SMD: Yes; Manufacturer1 Example: MURATA; Manufacturer1 ComponentHeight: 1.35mm; HelpURL: \\cern.ch\dfs\Applications\Altium\Datasheets\CC0805_X7R_MURATA.pdf; Author: CERN DEM JLC; CreateDate: 2012-04-30; LatestRevisionDate: 2012-04-30
C178 = CC0603_1UF_16V_10%_X7R: Non-polarised capacitor; Part Description: SMD Multilayer Chip Ceramic Capacitor; Manufacturer: GENERIC; Manufacturer1 Part Number: 223824613663; Tolerance: ±10%; Table: Capacitors SMD; Part Number: CC0603_1UF_16V_10%_X7R; Component Kind: Standard; Component Type: Standard; Pin Count: 2; Value: 1uF; Status: Preferred; Manufacturer Part Number: CC0603_1uF_16V_10%_X7R; Mounted: Yes; Socket: No; SMD: Yes; Manufacturer1 Example: PHYCOMP; Manufacturer1 ComponentHeight: 0.87mm; HelpURL: \\cern.ch\dfs\Applications\Altium\Datasheets\CC0805_X5R_PHYCOMP_HC.pdf; Author: CERN DEM JLC; CreateDate: 12/3/2007; LatestRevisionDate: 12/3/2007
C184-C187 = CC0402_10PF_50V_5%_NP0: Non-polarised capacitor; Part Description: SMD Multilayer Chip Ceramic Capacitor; Manufacturer: GENERIC; Manufacturer1 Part Number: 223886915109; Voltage: 50V; TC: NP0; Tolerance: ±5%; Table: Capacitors SMD; Part Number: CC0402_10PF_50V_5%_NP0; Component Kind: Standard; Component Type: Standard; Pin Count: 2; Value: 10pF; Status: Not Recommended; Manufacturer Part Number: CC0402_10PF_50V_5%_NP0; Case: 0402; Mounted: Yes; Socket: No; SMD: Yes; Manufacturer1 Example: PHYCOMP; Manufacturer1 ComponentHeight: 0.55mm; HelpURL: \\cern.ch\dfs\Applications\Altium\Datasheets\CC0402_NP0_PHYCOMP.pdf; Author: CERN DEM JLC; CreateDate: 2007-12-03; LatestRevisionDate: 2007-12-03
C189 C190 = CC0402_22PF_50V_5%_NP0: Non-polarised capacitor; Part Description: SMD Multilayer Chip Ceramic Capacitor; Manufacturer: GENERIC; Manufacturer1 Part Number: 223886915229; Voltage: 50V; TC: NP0; Tolerance: ±5%; Table: Capacitors SMD; Part Number: CC0402_22PF_50V_5%_NP0; Component Kind: Standard; Component Type: Standard; Pin Count: 2; Value: 22pF; Status: Not Recommended; Manufacturer Part Number: CC0402_22PF_50V_5%_NP0; Case: 0402; Mounted: Yes; Socket: No; SMD: Yes; Manufacturer1 Example: PHYCOMP; Manufacturer1 ComponentHeight: 0.55mm; HelpURL: \\cern.ch\dfs\Applications\Altium\Datasheets\CC0402_NP0_PHYCOMP.pdf; Author: CERN DEM JLC; CreateDate: 2007-12-03; LatestRevisionDate: 2007-12-03
FB8 = IND0805_MURATA_BLM21PG221SN1D: Inductor; Part Description: SMD EMIFIL Suppression Chip Ferrite Bead; Manufacturer: MURATA; Power: 2A; Resistance: 0.05R; Tolerance: ±25%; Table: Inductors SMD; Part Number: IND0805_MURATA_BLM21PG221SN1D; Component Kind: Standard; Component Type: Standard; Pin Count: 2; Value: 220R@100MHz; Status: None; Manufacturer Part Number: BLM21PG221SN1D; Case: 0805; Mounted: Yes; Socket: No; SMD: Yes; ComponentHeight: 1.05mm; HelpURL: \\cern.ch\dfs\Applications\Altium\Datasheets\IND0402_MURATA_BLM21P.pdf; Author: CERN DEM JLC; CreateDate: 2010-01-25; LatestRevisionDate: 2010-01-25
IC14 = IFC_LAN8710A: RMII ethernet transceiver with auto MIDIX
R171 R174-R176 R179-R181 = R0402_10K_1%_0.0625W_100PPM: as R101 on sheet Supply; Part Number: R0402_10K_1%_0.0625W_100PPM; Component Kind: Standard; Component Type: Standard; Pin Count: 2; Value: 10k; Status: Not recommended; Power: 0.0625W; Tolerance: ±1%; Manufacturer Part Number: R0402_10K_1%_0.0625W_100PPM; Case: 0402; Mounted: Yes; Socket: No; SMD: Yes; Manufacturer1 Example: YAGEO PHYCOMP; Manufacturer1 ComponentHeight: 0.4mm; HelpURL: \\cern.ch\dfs\Applications\Altium\Datasheets\R0402_Phycomp_RC0402.pdf; Author: CERN DEM JLC; CreateDate: 2007-12-03; LatestRevisionDate: 2012-10-17
R172 R173 R177 R178 = R0402_49R9_1%_0.0625W_100PPM: Resistor - 1%; Part Description: General Purpose Thick Film Chip Resistor; Manufacturer: GENERIC; Manufacturer1 Part Number: 232270674999L or RC0402FR-0749R9L; TC: ±100ppm/°C; Table: Resistors SMD; Part Number: R0402_49R9_1%_0.0625W_100PPM; Component Kind: Standard; Component Type: Standard; Pin Count: 2; Value: 49R9; Status: Not recommended; Power: 0.0625W; Tolerance: ±1%; Manufacturer Part Number: R0402_49R9_1%_0.0625W_100PPM; Case: 0402; Mounted: Yes; Socket: No; SMD: Yes; Manufacturer1 Example: YAGEO PHYCOMP; Manufacturer1 ComponentHeight: 0.4mm; HelpURL: \\cern.ch\dfs\Applications\Altium\Datasheets\R0402_Phycomp_RC0402.pdf; Author: CERN DEM JLC; CreateDate: 2012-10-24; LatestRevisionDate: 2012-10-24
R182 = R0402_12K1_1%_0.0625W_100PPM: Resistor - 1%; Part Description: General Purpose Thick Film Chip Resistor; Manufacturer: GENERIC; Manufacturer1 Part Number: 232270671213L or RC0402FR-0712K1L; TC: ±100ppm/°C; Table: Resistors SMD; Part Number: R0402_12K1_1%_0.0625W_100PPM; Component Kind: Standard; Component Type: Standard; Pin Count: 2; Value: 12k1; Status: Not recommended; Power: 0.0625W; Tolerance: ±1%; Manufacturer Part Number: R0402_12K1_1%_0.0625W_100PPM; Case: 0402; Mounted: Yes; Socket: No; SMD: Yes; Manufacturer1 Example: YAGEO PHYCOMP; Manufacturer1 ComponentHeight: 0.4mm; HelpURL: \\cern.ch\dfs\Applications\Altium\Datasheets\R0402_Phycomp_RC0402.pdf; Author: CERN DEM JLC; CreateDate: 2012-10-24; LatestRevisionDate: 2012-10-24
R183 = R0603_0R_JUMPER: Resistor - 1%; Part Description: 1A (0.05R Max DC Resistance) Zero Ohm Jumper; Manufacturer: GENERIC; Manufacturer1 Part Number: NRC06Z0; Table: Resistors SMD; Part Number: R0603_0R_JUMPER; Component Kind: Standard; Component Type: Standard; Pin Count: 2; Value: 0; Status: Preferred; Manufacturer Part Number: R0603_0R_JUMPER; Case: 0603; Mounted: Yes; Socket: No; SMD: Yes; Manufacturer1 Example: NIC COMPONENT; Manufacturer1 ComponentHeight: 0.55mm; HelpURL: \\cern.ch\dfs\Applications\Altium\Datasheets\R0603_NIC_NRC.pdf; Author: CERN DEM JLC; CreateDate: 2007-12-03; LatestRevisionDate: 2008-03-13
X2 = X_CRYSTAL_SMD_5.0*3.2: miniature crystal oscillator (Maritex)

## Sheet ETH_CON.SchDoc: ETH CON
size 420 x 297 mm; DocumentNumber: 4; SheetNumber: 13; SheetTotal: 15
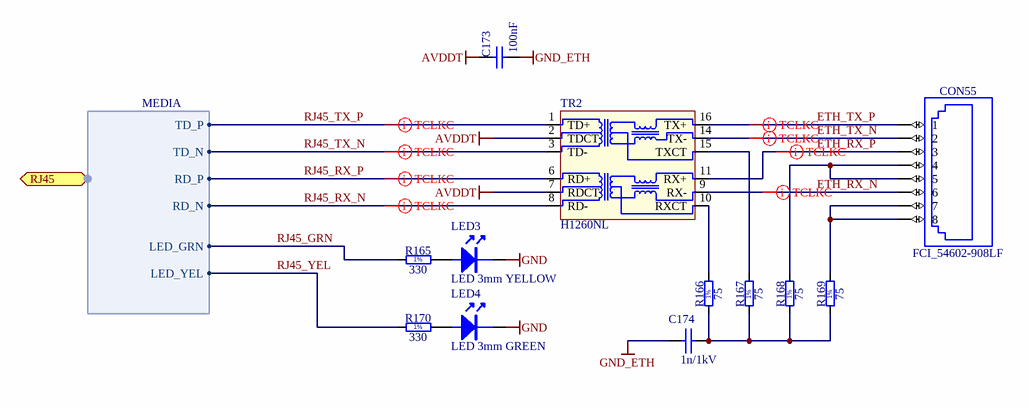
[diagram p12: ETH_CON.SchDoc]

### Parts
C173  100nF  [CAPC1005X55N]
C174  1n/1kV  [cap_ceram]
CON55  FCI_54602-908LF  [FCI_54602-908LF]
LED3  LED 3mm YELLOW  [LED]
LED4  LED 3mm GREEN  [LED]
R165  330  [RESC1608X55N]
R166  75  [RESC1608X55N]
R167  75  [RESC1608X55N]
R168  75  [RESC1608X55N]
R169  75  [RESC1608X55N]
R170  330  [RESC1608X55N]
TR2  H1260NL  [H1260NL]

### Ports
RJ45 (harness MEDIA)

### Harnesses
MEDIA: TD_P, TD_N, RD_P, RD_N, LED_GRN, LED_YEL

### Nets
AVDDT: C173.2 TR2.2(TDCT) TR2.7(RDCT)
GND: LED3.K LED4.K
GND_ETH: C173.1 C174.1
ETH_RX_N: CON55.6 TR2.9(RX-)
ETH_RX_P: CON55.3 TR2.11(RX+)
ETH_TX_N: CON55.2 TR2.14(TX-)
ETH_TX_P: CON55.1 TR2.16(TX+)
RJ45_GRN: R165.1 ; port RJ45.LED_GRN  [project net RJ45.LED_GRN]
RJ45_RX_N: TR2.8(RD-) ; port RJ45.RD_N  [project net RJ45.RD_N]
RJ45_RX_P: TR2.6(RD+) ; port RJ45.RD_P  [project net RJ45.RD_P]
RJ45_TX_N: TR2.3(TD-) ; port RJ45.TD_N  [project net RJ45.TD_N]
RJ45_TX_P: TR2.1(TD+) ; port RJ45.TD_P  [project net RJ45.TD_P]
RJ45_YEL: R170.1 ; port RJ45.LED_YEL  [project net RJ45.LED_YEL]
NetC174_2: C174.2 R166.1 R167.1 R168.1 R169.1
NetCON55_4: CON55.4 CON55.5 R168.2
NetCON55_7: CON55.7 CON55.8 R169.2
NetLED3_A: LED3.A R165.2
NetLED4_A: LED4.A R170.2
NetR166_2: R166.2 TR2.10(RXCT)
NetR167_2: R167.2 TR2.15(TXCT)

### Layout directives
differential pair: ETH_RX_N, ETH_RX_P, ETH_TX_N, ETH_TX_P, RJ45.RD_N, RJ45.RD_P, RJ45.TD_N, RJ45.TD_P

### Notes on the sheet
- Project/Equipment
- Document
- uTCA RTM 8 SFP+
- Designer
- Drawn by
- Check.by
- Copyright Creotech Instruments SA 2014.
  This documentation describes Open Hardware and is licensed under the CERN OHL v.1.1. You may redistribute and modify this documentation under the terms of the CERN OHL v.1.1. (http://ohwr.org/CERNOHL). This documentation is distributed WITHOUT ANY EXPRESS OR IMPLIED WARRANTY, INCLUDING OF MERCHANTABILITY, SATISFACTORY QUALITY AND FITNESS FOR A PARTICULAR PURPOSE. Please see the CERN OHL v.1.1 for applicable conditions.
- Creotech Instruments S.A.
- File
- Last Mod.
- Print Date
- Sheet
- Size
- A3
- of
- Rev
- (in symbol R0603_75R_1%_0.1W_100PPM) 1%
- (in symbol R0603_330R_1%_0.1W_100PPM) 1%

### Library data of the parts
C173 = CC0402_100NF_16V_10%_X7R: as C175 on sheet ETH_PHY; Part Number: CC0402_100NF_16V_10%_X7R; Component Kind: Standard; Component Type: Standard; Pin Count: 2; Value: 100nF; Status: Not Recommended; Manufacturer Part Number: CC0402_100NF_16V_10%_X7R; Case: 0402; Mounted: Yes; Socket: No; SMD: Yes; Manufacturer1 Example: PHYCOMP; Manufacturer1 ComponentHeight: 0.55mm; HelpURL: \\cern.ch\dfs\Applications\Altium\Datasheets\CC0402_X7R_PHYCOMP.pdf; Author: CERN DEM JLC; CreateDate: 2007-12-03; LatestRevisionDate: 2007-12-03
C174 = CAP: Capacitor
CON55 = FCI_54602-908LF: 1 Port, 8 Positions, CAT3 RJ45 Horizontal Modular Jack; Manufacturer: FCI; Part Number: FCI_54602-908LF; Component Kind: Standard; Component Type: Standard; Pin Count: 8; Family: RJ45; Mounted: Yes; Socket: No; SMD: No; Status: None; Part Description: 1 Port, 8 Positions, CAT3 RJ45 Horizontal Modular Jack; Manufacturer Part Number: 54602-908LF; ComponentHeight: 10.43mm; HelpURL: \\cern.ch\dfs\Applications\Altium\Datasheets\FCI_54602-908LF.pdf; Author: CERN DEM JLC; CreateDate: 2013-01-28; LatestRevisionDate: 2013-01-28; Table: FCI
LED3 LED4 = LED
R165 R170 = R0603_330R_1%_0.1W_100PPM: Resistor - 1%; Part Description: General Purpose Thick Film Chip Resistor; Manufacturer: GENERIC; Manufacturer1 Part Number: NRC06F3300TRF; Power: 0.1W; TC: ±100ppm/°C; Table: Resistors SMD; Part Number: R0603_330R_1%_0.1W_100PPM; Component Kind: Standard; Component Type: Standard; Pin Count: 2; Value: 330; Status: Preferred; Tolerance: ±1%; Manufacturer Part Number: R0603_330R_1%_0.1W_100PPM; Case: 0603; Mounted: Yes; Socket: No; SMD: Yes; Manufacturer1 Example: NIC COMPONENT; Manufacturer1 ComponentHeight: 0.55mm; HelpURL: \\cern.ch\dfs\Applications\Altium\Datasheets\R0603_NIC_NRC.pdf; Author: CERN DEM JLC; CreateDate: 2007-12-03; LatestRevisionDate: 2008-03-13
R166-R169 = R0603_75R_1%_0.1W_100PPM: Resistor - 1%; Part Description: General Purpose Thick Film Chip Resistor; Manufacturer: GENERIC; Manufacturer1 Part Number: NRC06F75R0TRF; Power: 0.1W; TC: ±100ppm/°C; Table: Resistors SMD; Part Number: R0603_75R_1%_0.1W_100PPM; Component Kind: Standard; Component Type: Standard; Pin Count: 2; Value: 75; Status: Preferred; Tolerance: ±1%; Manufacturer Part Number: R0603_75R_1%_0.1W_100PPM; Case: 0603; Mounted: Yes; Socket: No; SMD: Yes; Manufacturer1 Example: NIC COMPONENT; Manufacturer1 ComponentHeight: 0.55mm; HelpURL: \\cern.ch\dfs\Applications\Altium\Datasheets\R0603_NIC_NRC.pdf; Author: CERN DEM JLC; CreateDate: 2007-12-03; LatestRevisionDate: 2008-03-13
TR2 = TR_H1260NL: ethernet trafo (TME)

## Sheet MGT.SchDoc: MGT
size 420 x 297 mm; DocumentNumber: 7; SheetNumber: 9; SheetTotal: 15
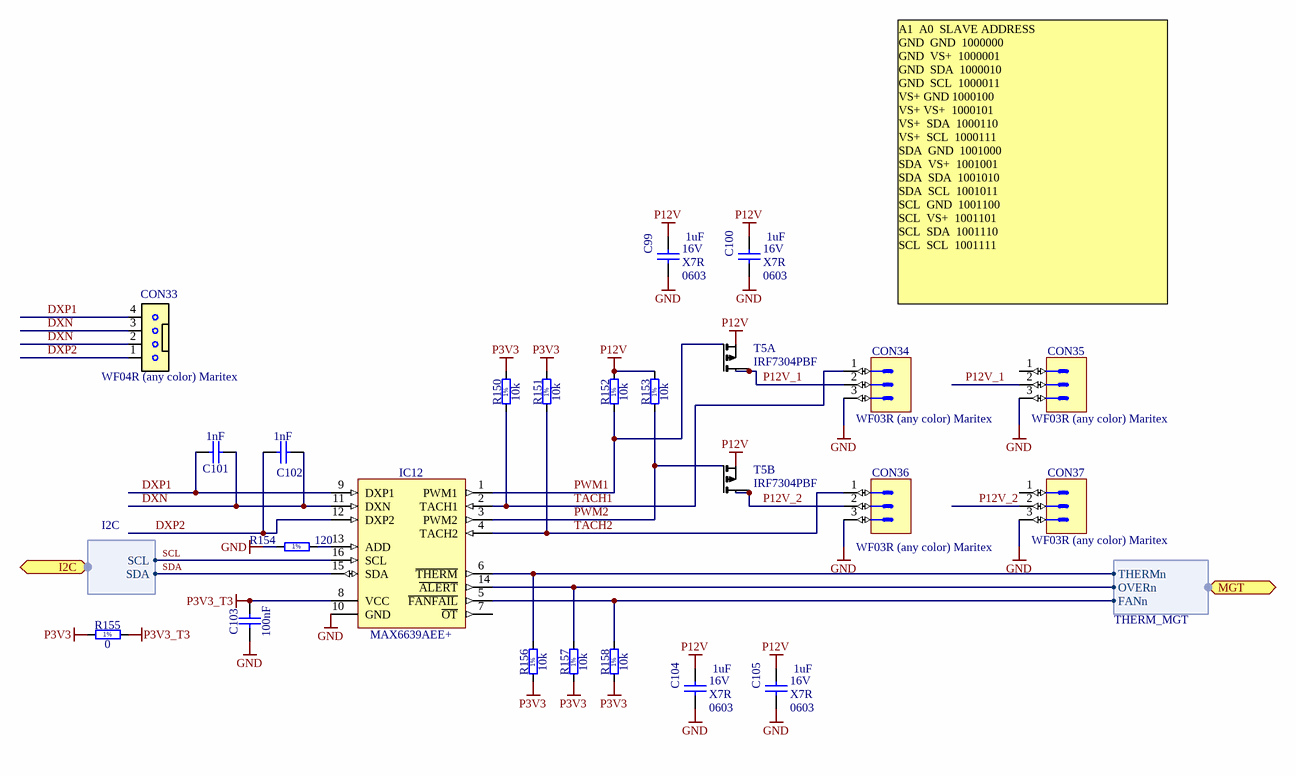
[diagram p13: MGT.SchDoc]

### Parts
C99  1uF  Voltage: 16V  TC: X7R  Case: 0603  [CAPC1608X87N]
C100  1uF  Voltage: 16V  TC: X7R  Case: 0603  [CAPC1608X87N]
C101  1nF  [CAPC1608X87N]
C102  1nF  [CAPC1608X87N]
C103  100nF  [CAPC0603X33N]
C104  1uF  Voltage: 16V  TC: X7R  Case: 0603  [CAPC1608X87N]
C105  1uF  Voltage: 16V  TC: X7R  Case: 0603  [CAPC1608X87N]
CON33  WF04R (any color) Maritex  [CON_0022057048]
CON34  WF03R (any color) Maritex  [MOLEX_22-05-7038]
CON35  WF03R (any color) Maritex  [MOLEX_22-05-7038]
CON36  WF03R (any color) Maritex  [MOLEX_22-05-7038]
CON37  WF03R (any color) Maritex  [MOLEX_22-05-7038]
IC12  MAX6639AEE+  [SOP63P600X175-16N]
R150  10k  [RESC1005X40N]
R151  10k  [RESC1005X40N]
R152  10k  [RESC1005X40N]
R153  10k  [RESC1005X40N]
R154  120  [RESC1005X40N]
R155  0  [RESC1608X55N]
R156  10k  [RESC1005X40N]
R157  10k  [RESC1005X40N]
R158  10k  [RESC1005X40N]
T5  IRF7304PBF  [so-8]  (parts A,B of 2)

### Ports
I2C (harness I2C), MGT (harness THERM_MGT)

### Harnesses
I2C: SCL, SDA
THERM_MGT: OVERn, THERMn, FANn

### Nets
GND: C99.1 C100.1 C103.1 C104.1 C105.1 CON34.3 CON35.3 CON36.3 CON37.3 IC12.10(GND) R154.1
P3V3: R150.2 R151.2 R155.1 R156.1 R157.1 R158.1
P3V3_T3: C103.2 IC12.8(VCC) R155.2
P12V: C99.2 C100.2 C104.2 C105.2 R152.2 R153.2 T5.1(S1) T5.3(S2)
DXN: C101.1 C102.1 CON33.2 CON33.3 IC12.11(DXN)
DXP1: C101.2 CON33.4 IC12.9(DXP1)
DXP2: C102.2 CON33.1 IC12.12(DXP2)
MGT.FANn: IC12.5(~{FANFAIL}) R158.2 ; port MGT.FANn
MGT.OVERn: IC12.14(~{ALERT}) R157.2 ; port MGT.OVERn
MGT.THERMn: IC12.6(~{THERM}) R156.2 ; port MGT.THERMn
P12V_1: CON34.2 CON35.2 T5.7(D1) T5.8(D1)
P12V_2: CON36.2 CON37.2 T5.5(D2) T5.6(D2)
PWM1: IC12.1(PWM1) R152.1 T5.2(G1)
PWM2: IC12.3(PWM2) R153.1 T5.4(G2)
SCL: IC12.16(SCL) ; port I2C.SCL  [project net MBUS.SCL]
SDA: IC12.15(SDA) ; port I2C.SDA  [project net MBUS.SDA]
TACH1: CON34.1 IC12.2(TACH1) R150.1
TACH2: CON36.1 IC12.4(TACH2) R151.1
NetIC12_13: IC12.13(ADD) R154.2

Not connected (* = marked no-connect by the designer): CON35 1; CON37 1; IC12 7(~{OT})

### Notes on the sheet
- A1 	A0 	SLAVE ADDRESS
  GND 	GND 	1000000
  GND 	VS+ 	1000001
  GND 	SDA 	1000010
  GND 	SCL 	1000011
  VS+	GND	1000100
  VS+	VS+ 	1000101
  VS+ 	SDA 	1000110
  VS+ 	SCL 	1000111
  SDA 	GND 	1001000
  SDA 	VS+ 	1001001
  SDA 	SDA 	1001010
  SDA 	SCL 	1001011
  SCL 	GND 	1001100
  SCL 	VS+ 	1001101
  SCL 	SDA 	1001110
  SCL 	SCL 	1001111
- Project/Equipment
- Document
- uTCA RTM 8 SFP+
- Designer
- Drawn by
- Check.by
- Copyright Creotech Instruments SA 2014.
  This documentation describes Open Hardware and is licensed under the CERN OHL v.1.1. You may redistribute and modify this documentation under the terms of the CERN OHL v.1.1. (http://ohwr.org/CERNOHL). This documentation is distributed WITHOUT ANY EXPRESS OR IMPLIED WARRANTY, INCLUDING OF MERCHANTABILITY, SATISFACTORY QUALITY AND FITNESS FOR A PARTICULAR PURPOSE. Please see the CERN OHL v.1.1 for applicable conditions.
- Creotech Instruments S.A.
- File
- Last Mod.
- Print Date
- Sheet
- Size
- A3
- of
- Rev
- (in symbol R0402_10K_1%_0.0625W_100PPM) 1%
- (in symbol R0402_120R_1%_0.0625W_100PPM) 1%
- (in symbol R0603_0R_JUMPER) 1%

### Library data of the parts
C99 C100 C104 C105 = CC0603_1UF_16V_10%_X7R: as C178 on sheet ETH_PHY; Part Number: CC0603_1UF_16V_10%_X7R; Component Kind: Standard; Component Type: Standard; Pin Count: 2; Value: 1uF; Status: Preferred; Manufacturer Part Number: CC0603_1uF_16V_10%_X7R; Mounted: Yes; Socket: No; SMD: Yes; Manufacturer1 Example: PHYCOMP; Manufacturer1 ComponentHeight: 0.87mm; HelpURL: \\cern.ch\dfs\Applications\Altium\Datasheets\CC0805_X5R_PHYCOMP_HC.pdf; Author: CERN DEM JLC; CreateDate: 12/3/2007; LatestRevisionDate: 12/3/2007
C101 C102 = CC0603_1NF_50V_10%_X7R: Non-polarised capacitor; Part Description: SMD Multilayer Chip Ceramic Capacitor; Manufacturer: GENERIC; Manufacturer1 Part Number: 223858615623; Voltage: 50V; TC: X7R; Tolerance: ±10%; Table: Capacitors SMD; Part Number: CC0603_1NF_50V_10%_X7R; Component Kind: Standard; Component Type: Standard; Pin Count: 2; Value: 1nF; Status: Preferred; Manufacturer Part Number: CC0603_1NF_50V_10%_X7R; Case: 0603; Mounted: Yes; Socket: No; SMD: Yes; Manufacturer1 Example: PHYCOMP; Manufacturer1 ComponentHeight: 0.87mm; HelpURL: \\cern.ch\dfs\Applications\Altium\Datasheets\CC0603_X7R_PHYCOMP.pdf; Author: CERN DEM JLC; CreateDate: 2007-12-03; LatestRevisionDate: 2007-12-03
C103 = CC0201_100NF_6.3V_10%_X5R: as C74-C78 on sheet AMC; Part Number: CC0201_100NF_6.3V_10%_X5R; Component Kind: Standard; Component Type: Standard; Pin Count: 2; Value: 100nF; Status: Not Recommended; Manufacturer Part Number: CC0201_100NF_6.3V_10%_X5R; Case: 0201; Mounted: Yes; Socket: No; SMD: Yes; Manufacturer1 Example: AVX; Manufacturer1 ComponentHeight: 0.33mm; HelpURL: \\cern.ch\dfs\Applications\Altium\Datasheets\CC0201_X5R_AVX.pdf; Author: CERN DEM JLC; CreateDate: 2007-12-03; LatestRevisionDate: 2007-12-03
CON33 = CON_4_2.54_RA_key: 2.54mm crimped terminal header
CON34-CON37 = MOLEX_22-05-7038: Connector 3 Male; Part Description: 2.54mm (.100") Pitch KK® Wire-To-Board Header, Right Angle, With Friction Lock, 3 Circuits; Manufacturer: MOLEX; Part Number: MOLEX_22-05-7038; Component Kind: Standard; Component Type: Standard; Pin Count: 3; Family: KK®; Mounted: Yes; Socket: No; SMD: No; Status: None; Manufacturer Part Number: 22-05-7038; ComponentHeight: 5.8mm; HelpURL: \\cern.ch\dfs\Applications\Altium\Datasheets\MOLEX_22-05-7038.pdf; Author: CERN DEM JLC; CreateDate: 2012-09-19; LatestRevisionDate: 2012-09-19; Table: MOLEX
IC12 = MAX6639AEE+: 2-Channel Temperature Monitor with Dual, Automatic, PWM Fan-Speed Controller; Manufacturer: MAXIM; Table: Analog & Interface; Part Number: MAX6639AEE+; Component Kind: Standard; Component Type: Standard; Device: MAX6639AEE+; PackageDescription: SOP, 0.635mm pitch; 16 pin, 3.9mm W X 4.895mm L X 1.75mm H Body, IPC Medium Density; Part Description: 2-Channel Temperature Monitor with Dual, Automatic, PWM Fan-Speed Controller; Manufacturer Part Number: MAX6639AEE+; Pin Count: 16; Case: SSOP16; Mounted: Yes; Socket: No; SMD: Yes; ComponentHeight: 1.75mm; Author: CERN DEM JLC; HelpURL: \\cern.ch\dfs\Applications\Altium\Datasheets\MAX6639AEE+.pdf; CreateDate: 2012-08-15; LatestRevisionDate: 2012-08-15
R150-R153 R156-R158 = R0402_10K_1%_0.0625W_100PPM: as R101 on sheet Supply; Part Number: R0402_10K_1%_0.0625W_100PPM; Component Kind: Standard; Component Type: Standard; Pin Count: 2; Value: 10k; Status: Not recommended; Power: 0.0625W; Tolerance: ±1%; Manufacturer Part Number: R0402_10K_1%_0.0625W_100PPM; Case: 0402; Mounted: Yes; Socket: No; SMD: Yes; Manufacturer1 Example: YAGEO PHYCOMP; Manufacturer1 ComponentHeight: 0.4mm; HelpURL: \\cern.ch\dfs\Applications\Altium\Datasheets\R0402_Phycomp_RC0402.pdf; Author: CERN DEM JLC; CreateDate: 2007-12-03; LatestRevisionDate: 2012-10-17
R154 = R0402_120R_1%_0.0625W_100PPM: Resistor - 1%; Part Description: General Purpose Thick Film Chip Resistor; Manufacturer: GENERIC; Manufacturer1 Part Number: 232270671201L; TC: ±100ppm/°C; Table: Resistors SMD; Part Number: R0402_120R_1%_0.0625W_100PPM; Component Kind: Standard; Component Type: Standard; Pin Count: 2; Value: 120; Status: Not recommended; Power: 0.0625W; Tolerance: ±1%; Manufacturer Part Number: R0402_120R_1%_0.0625W_100PPM; Case: 0402; Mounted: Yes; Socket: No; SMD: Yes; Manufacturer1 Example: YAGEO PHYCOMP; Manufacturer1 ComponentHeight: 0.4mm; HelpURL: \\cern.ch\dfs\Applications\Altium\Datasheets\R0402_Phycomp_RC0402.pdf; Author: CERN DEM JLC; CreateDate: 2007-12-03; LatestRevisionDate: 2012-10-17
R155 = R0603_0R_JUMPER: as R183 on sheet ETH_PHY; Part Number: R0603_0R_JUMPER; Component Kind: Standard; Component Type: Standard; Pin Count: 2; Value: 0; Status: Preferred; Manufacturer Part Number: R0603_0R_JUMPER; Case: 0603; Mounted: Yes; Socket: No; SMD: Yes; Manufacturer1 Example: NIC COMPONENT; Manufacturer1 ComponentHeight: 0.55mm; HelpURL: \\cern.ch\dfs\Applications\Altium\Datasheets\R0603_NIC_NRC.pdf; Author: CERN DEM JLC; CreateDate: 2007-12-03; LatestRevisionDate: 2008-03-13
T5 = Q_IRF7304: dual PMOS   20V 4,3A 2,0W 0,09R